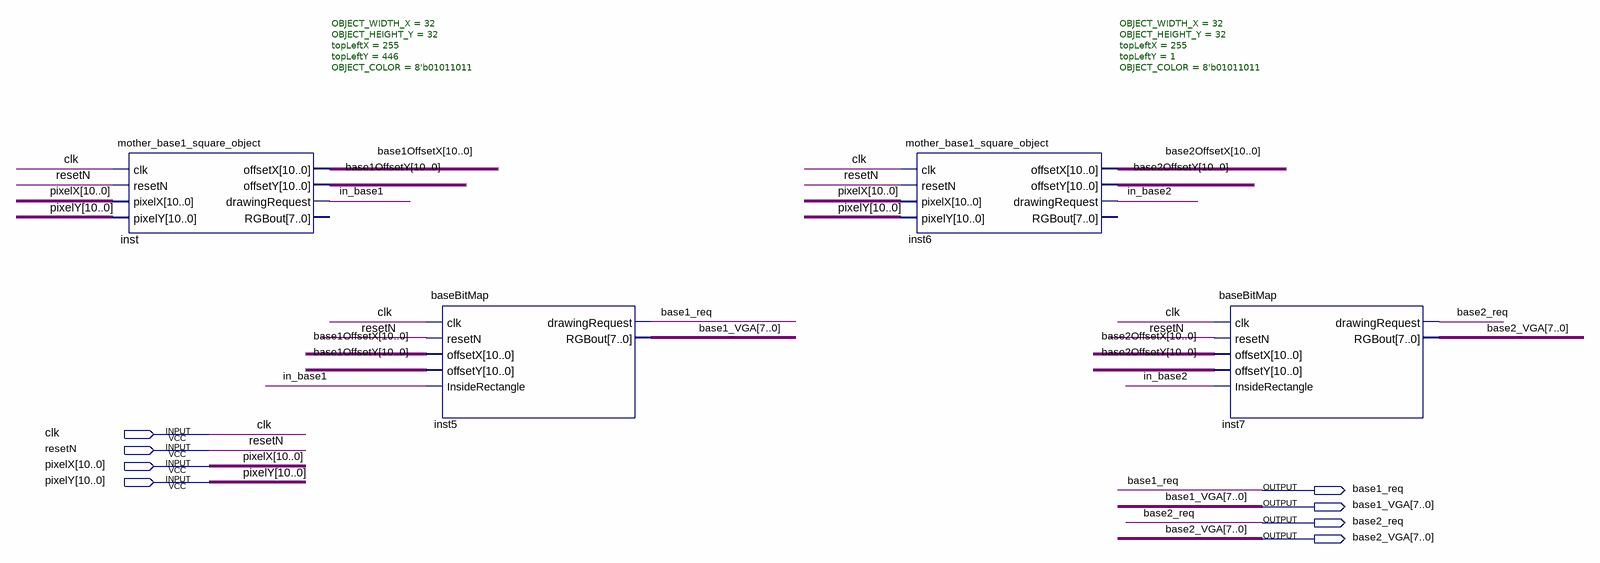
[diagram p0: schematic sheet]
// Quartus schematic base.bdf as structural Verilog: 4 symbols, 8 pins
module base (
  input  clk,
  input  resetN,
  input  [10:0] pixelX,
  input  [10:0] pixelY,
  output base1_req,
  output [7:0] base1_VGA,
  output base2_req,
  output [7:0] base2_VGA
);

  wire in_base1, in_base2;
  wire [10:0] base1OffsetX, base1OffsetY, base2OffsetX, base2OffsetY;

  mother_base1_square_object #(.OBJECT_WIDTH_X(32), .OBJECT_HEIGHT_Y(32), .topLeftX(255), .topLeftY(446), .OBJECT_COLOR(8'b01011011)) inst (
    .clk(clk), .resetN(resetN), .pixelX(pixelX), .pixelY(pixelY), .offsetX(base1OffsetX),
    .offsetY(base1OffsetY), .drawingRequest(in_base1));  // open: RGBout
  baseBitMap inst5 (
    .clk(clk), .resetN(resetN), .offsetX(base1OffsetX), .offsetY(base1OffsetY), .InsideRectangle(in_base1),
    .drawingRequest(base1_req), .RGBout(base1_VGA));
  mother_base1_square_object #(.OBJECT_WIDTH_X(32), .OBJECT_HEIGHT_Y(32), .topLeftX(255), .topLeftY(1), .OBJECT_COLOR(8'b01011011)) inst6 (
    .clk(clk), .resetN(resetN), .pixelX(pixelX), .pixelY(pixelY), .offsetX(base2OffsetX),
    .offsetY(base2OffsetY), .drawingRequest(in_base2));  // open: RGBout
  baseBitMap inst7 (
    .clk(clk), .resetN(resetN), .offsetX(base2OffsetX), .offsetY(base2OffsetY), .InsideRectangle(in_base2),
    .drawingRequest(base2_req), .RGBout(base2_VGA));
endmodule
